# Altium schematic sheet Microprocessor Module_0.SchDoc
size A4; SheetNumber: 1; SheetTotal: 4
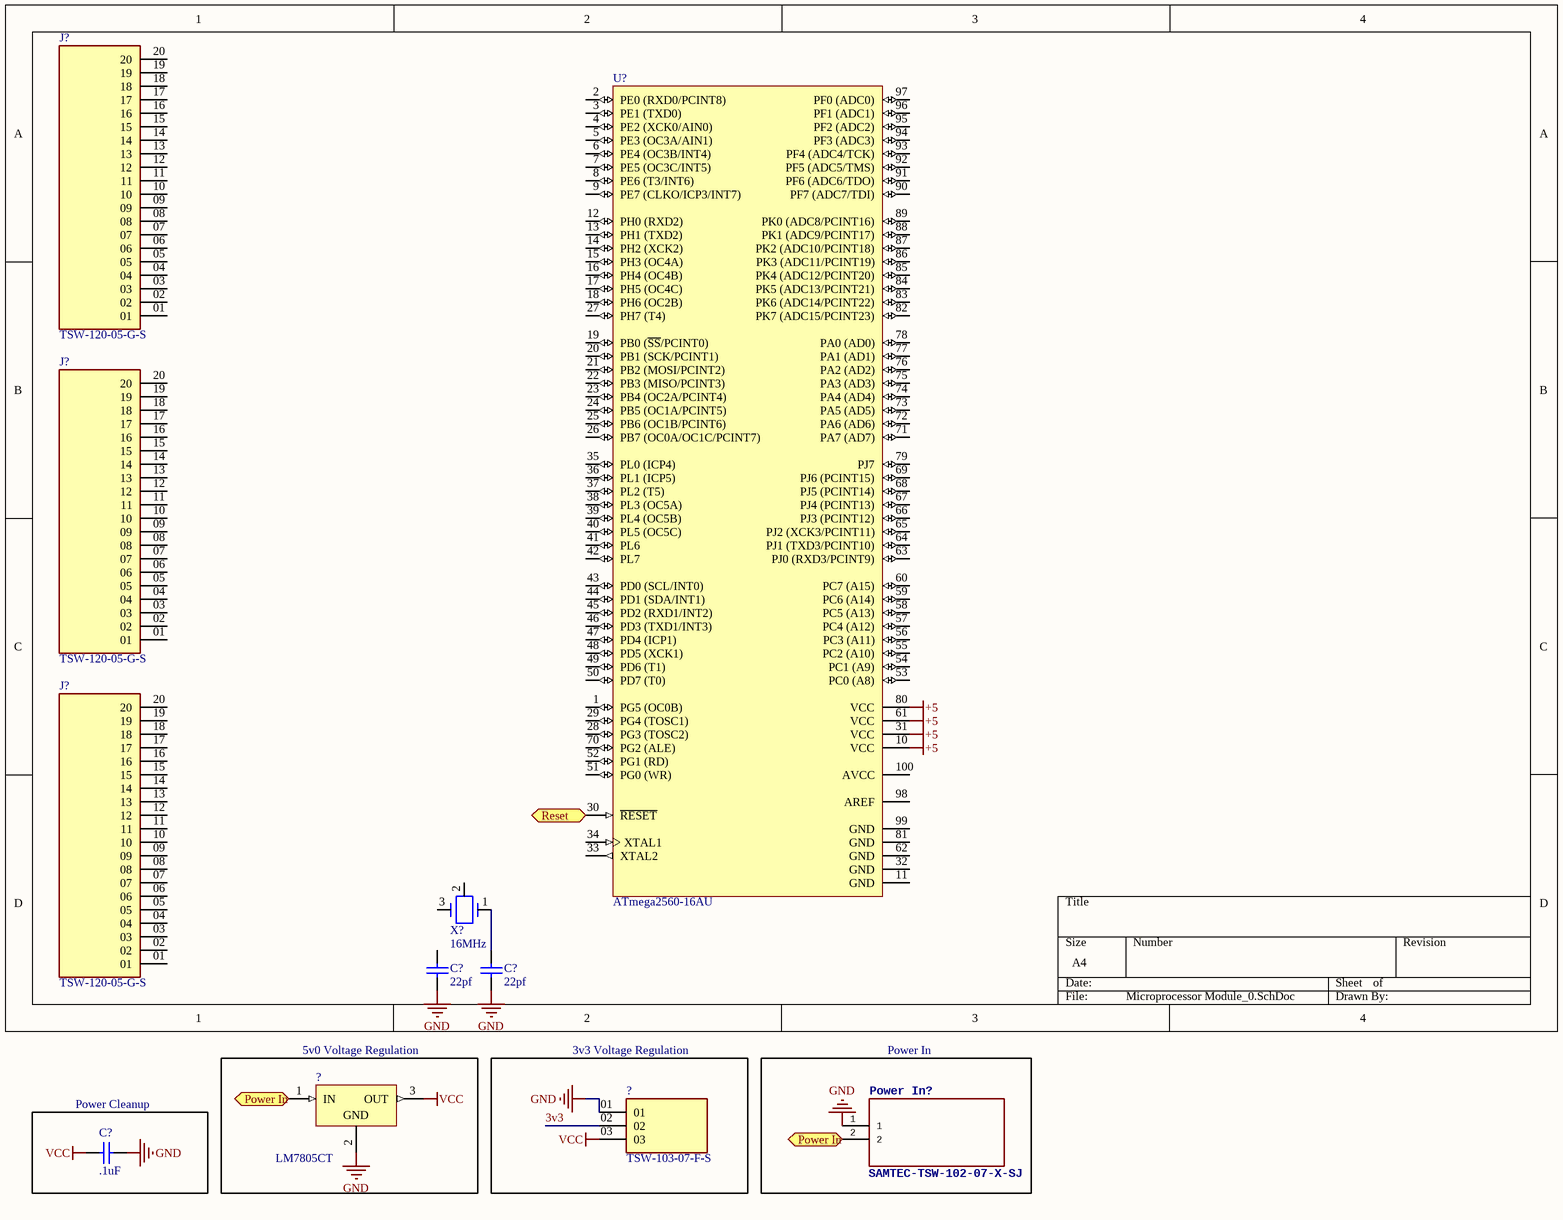
[diagram p0: Microprocessor Module_0.SchDoc]

## Parts
(Parts that share a designator on the sheet are numbered #1, #2 ... from top to bottom, then left to right.)
?#1  LM7805CT  [FAIR-TO-220-3]
?#2  TSW-103-07-F-S  [SAMTEC_TSW-103-07-F-S]
C?#1  22pf  [KEMT-C330C105M5U5TA]
C?#2  22pf  [KEMT-C330C105M5U5TA]
C?#3  .1uF  [KEMT-C330C105M5U5TA]
J?#1  TSW-120-05-G-S  [SAMTEC_TSW-120-05-G-S]
J?#2  TSW-120-05-G-S  [SAMTEC_TSW-120-05-G-S]
J?#3  TSW-120-05-G-S  [SAMTEC_TSW-120-05-G-S]
Power_In?  SAMTEC-TSW-102-07-X-SJ  [SAMTEC-TSW-102-07-X-S]
U?  ATmega2560-16AU  [100A_M]
X?  16MHz  [ECS-4X-3IL]

## Blocks framed on the sheet
5v0 Voltage Regulation: ?#1
3v3 Voltage Regulation: ?#2
Power In: Power_In?
Power Cleanup: C?#3

## Ports
Power In (bidir, see Microprocessor Module (328)[1D], Microprocessor Module (328)[3D], Microprocessor Module_0[1E]), Power In (bidir, see Microprocessor Module (328)[1D], Microprocessor Module (328)[3D], Microprocessor Module_0[3E]), Reset (bidir, see Microprocessor Module_1[1A])

## Nets
+5: U?.10(VCC) U?.31(VCC) U?.61(VCC) U?.80(VCC)
GND: ?#1.2(GND) ?#2.01 C?#1.1 C?#2.1 C?#3.2 Power_In?.1
VCC: ?#1.3(OUT) ?#2.03 C?#3.1
3v3: ?#2.02
Power In: ?#1.1(IN) Power_In?.2 ; port Power In
Reset: U?.30(~{RESET}) ; port Reset
NetC?#2_2: C?#2.2 X?.1

Not connected (* = marked no-connect by the designer): C?#1 2; J?#1 01 02 03 04 05 06 07 08 09 10 11 12 13 14 15 16 17 18 19 20; J?#2 01 02 03 04 05 06 07 08 09 10 11 12 13 14 15 16 17 18 19 20; J?#3 01 02 03 04 05 06 07 08 09 10 11 12 13 14 15 16 17 18 19 20; U? 1(PG5_(OC0B)) 2(PE0_(RXD0/PCINT8)) 3(PE1_(TXD0)) 4(PE2_(XCK0/AIN0)) 5(PE3_(OC3A/AIN1)) 6(PE4_(OC3B/INT4)) 7(PE5_(OC3C/INT5)) 8(PE6_(T3/INT6)) 9(PE7_(CLKO/ICP3/INT7)) 11(GND) 12(PH0_(RXD2)) 13(PH1_(TXD2)) 14(PH2_(XCK2)) 15(PH3_(OC4A)) 16(PH4_(OC4B)) 17(PH5_(OC4C)) 18(PH6_(OC2B)) 19(PB0_(~{SS}/PCINT0)) 20(PB1_(SCK/PCINT1)) 21(PB2_(MOSI/PCINT2)) 22(PB3_(MISO/PCINT3)) 23(PB4_(OC2A/PCINT4)) 24(PB5_(OC1A/PCINT5)) 25(PB6_(OC1B/PCINT6)) 26(PB7_(OC0A/OC1C/PCINT7)) 27(PH7_(T4)) 28(PG3_(TOSC2)) 29(PG4_(TOSC1)) 32(GND) 33(XTAL2) 34(XTAL1) 35(PL0_(ICP4)) 36(PL1_(ICP5)) 37(PL2_(T5)) 38(PL3_(OC5A)) 39(PL4_(OC5B)) 40(PL5_(OC5C)) 41(PL6) 42(PL7) 43(PD0_(SCL/INT0)) 44(PD1_(SDA/INT1)) 45(PD2_(RXD1/INT2)) 46(PD3_(TXD1/INT3)) 47(PD4_(ICP1)) 48(PD5_(XCK1)) 49(PD6_(T1)) 50(PD7_(T0)) 51(PG0_(WR)) 52(PG1_(RD)) 53(PC0_(A8)) 54(PC1_(A9)) 55(PC2_(A10)) 56(PC3_(A11)) 57(PC4_(A12)) 58(PC5_(A13)) 59(PC6_(A14)) 60(PC7_(A15)) 62(GND) 63(PJ0_(RXD3/PCINT9)) 64(PJ1_(TXD3/PCINT10)) 65(PJ2_(XCK3/PCINT11)) 66(PJ3_(PCINT12)) 67(PJ4_(PCINT13)) 68(PJ5_(PCINT14)) 69(PJ6_(PCINT15)) 70(PG2_(ALE)) 71(PA7_(AD7)) 72(PA6_(AD6)) 73(PA5_(AD5)) 74(PA4_(AD4)) 75(PA3_(AD3)) 76(PA2_(AD2)) 77(PA1_(AD1)) 78(PA0_(AD0)) 79(PJ7) 81(GND) 82(PK7_(ADC15/PCINT23)) 83(PK6_(ADC14/PCINT22)) 84(PK5_(ADC13/PCINT21)) 85(PK4_(ADC12/PCINT20)) 86(PK3_(ADC11/PCINT19)) 87(PK2_(ADC10/PCINT18)) 88(PK1_(ADC9/PCINT17)) 89(PK0_(ADC8/PCINT16)) 90(PF7_(ADC7/TDI)) 91(PF6_(ADC6/TDO)) 92(PF5_(ADC5/TMS)) 93(PF4_(ADC4/TCK)) 94(PF3_(ADC3)) 95(PF2_(ADC2)) 96(PF1_(ADC1)) 97(PF0_(ADC0)) 98(AREF) 99(GND) 100(AVCC); X? 2 3

## Library data of the parts
?#1 = CMP-2000-04938-1: Positive Voltage Regulator, 5 V, 1 A, -40 to 125 degC, 3-Pin TO-220, RoHS, Tube; Manufacturer: FairchildSemiconductor; Maximum Input Voltage: 35V; Maximum Quiescent Current: 8mA; Load Regulation: 100mV; Maximum Output Current: 2.2(Typ)A; Output Type: Fixed; Typical Dropout Voltage @ Current: 2@1AV; Rad Hard: No; Output Voltage: 5V; Accuracy: ±4%; Number of Outputs: 1; Category: LinearRegulator; Package Description: 3-Pin Through Hole Device, Body 10 x 4.5 mm, Pitch 2.54 mm; Packaging: Rail/Tube; Mounting: ThroughHole; Polarity: Positive; Manufacturer URL: https://www.fairchildsemi.com/; Line Regulation: 100mV; Datasheet Version: Aug-12; Datasheet URL: https://datasheet.ciiva.com/26904/lm7805ct-26904988.pdf; Package Reference: TO-220; Package URL: https://www.fairchildsemi.com/package-drawings/TO/TO220B03.pdf; Package: 3TO-220AB; Operating Temperature: -40to125degC; Type: Linear
?#2 = TSW-103-07-F-S: MF: Samtec; Package: None; Price: None; MP: TSW-103-07-F-S; Availability: Unavailable; Value: *
C?#1-C?#3 = CMP-2000-06056-1: Ceramic Capacitor, 1 uF, +/- 20%, 50 V, -10 to 85 degC, 2-Pin THD, RoHS, Bulk; Manufacturer: Kemet; Voltage - Rated: 50V; Temperature Coefficient: Z5U; Catalog Drawings: C330(std); Product Training Modules: CapacitorBasics-TypicalUsesforCapacitors; Capacitance: 1µF; Online Catalog: GoldenMax™Series; Other Names: 399-4390; PCN Design/Specification: C3yySeriesGoldenMaxLeadConfiguration02/Feb/2015; Thickness (Max): -; Size / Dimension: 0.300"Lx0.150"W(7.62mmx3.81mm); Mounting Technology: ThroughHole; Tolerance: ±20%; Mounting Type: ThroughHole; Datasheet URL: http://www.kemet.com/Lists/ProductCatalog/Attachments/599/KEM_C1051_GOLDMAX_Z5U.pdf; Series: GoldenMax™; Standard Package: 250; Ratings: -; Applications: GeneralPurpose; Package Reference: C330C105M5U5TA; Packaging: Bulk; Category: Capacitors; Package Description: 2-Pin Through Hole Device, Body 7.11 x 4.07 mm; Operating Temperature: 10°C~85°C; Height - Seated (Max): 0.360"(9.14mm); Manufacturer URL: http://www.kemet.com/; Lead Spacing: 0.200"(5.08mm); Features: -; Lead Style: Straight; Package / Case: Radial; Family: CeramicCapacitors; Datasheet Version: 12/2015
U? = CMP-0095-00210-2: 8-bit AVR Microcontroller, 4.5-5.5V, 16MHz, 256KB Flash, 4KB EEPROM, 8KB SRAM, 86 GPIO pins, 100-pin TQFP, Industrial Grade (-40°C to 85°C), Pb-Free; PackageDescription: 100-Pin Thin Profile Plastic Quad Flat Pack (TQFP), 14 x 14 x 1.0 mm Body, 0.5 mm Pitch; ComponentLink1Description: Manufacturer URL; ComponentLink3URL: http://www.atmel.com/dyn/resources/prod_documents/2549S.pdf; RevisionNote: DatasheetVersion & PackageVersion updated. URLs added.; DatasheetVersion: revN, May-2011; ComponentLink2Description: ATmega640/1280/1281/2560/2561 Datasheet; PackageReference: 100A; PackageVersion: revD, Oct-2010; Code_JEDEC: MS-026-AED; ComponentLink1URL: http://www.atmel.com/; ComponentLink2URL: http://www.atmel.com/dyn/resources/prod_documents/doc2549.pdf; ComponentLink3Description: ATmega640/1280/1281/2560/2561 Summary
X? = CMP-1669-00002-2: CRYSTAL 8.00 MHZ 20PF 49US; PartNumber: ECS-80-20-4X; Manufacturer: ECS; ComponentLink1URL: http://www.ecsxtal.com/store/pdf/hc-49usx.pdf; ComponentLink1Description: Datasheet; PackageReference: 4X-3IL
J?#1-J?#3 = TSW-120-05-G-S: Package: None; Price: None; Value: *; MP: TSW-120-05-G-S; Availability: Unavailable